# Altium schematic sheet 452006257#BDU控制板1-电源.SchDoc
size A3; SheetNumber: 8; SheetTotal: 14
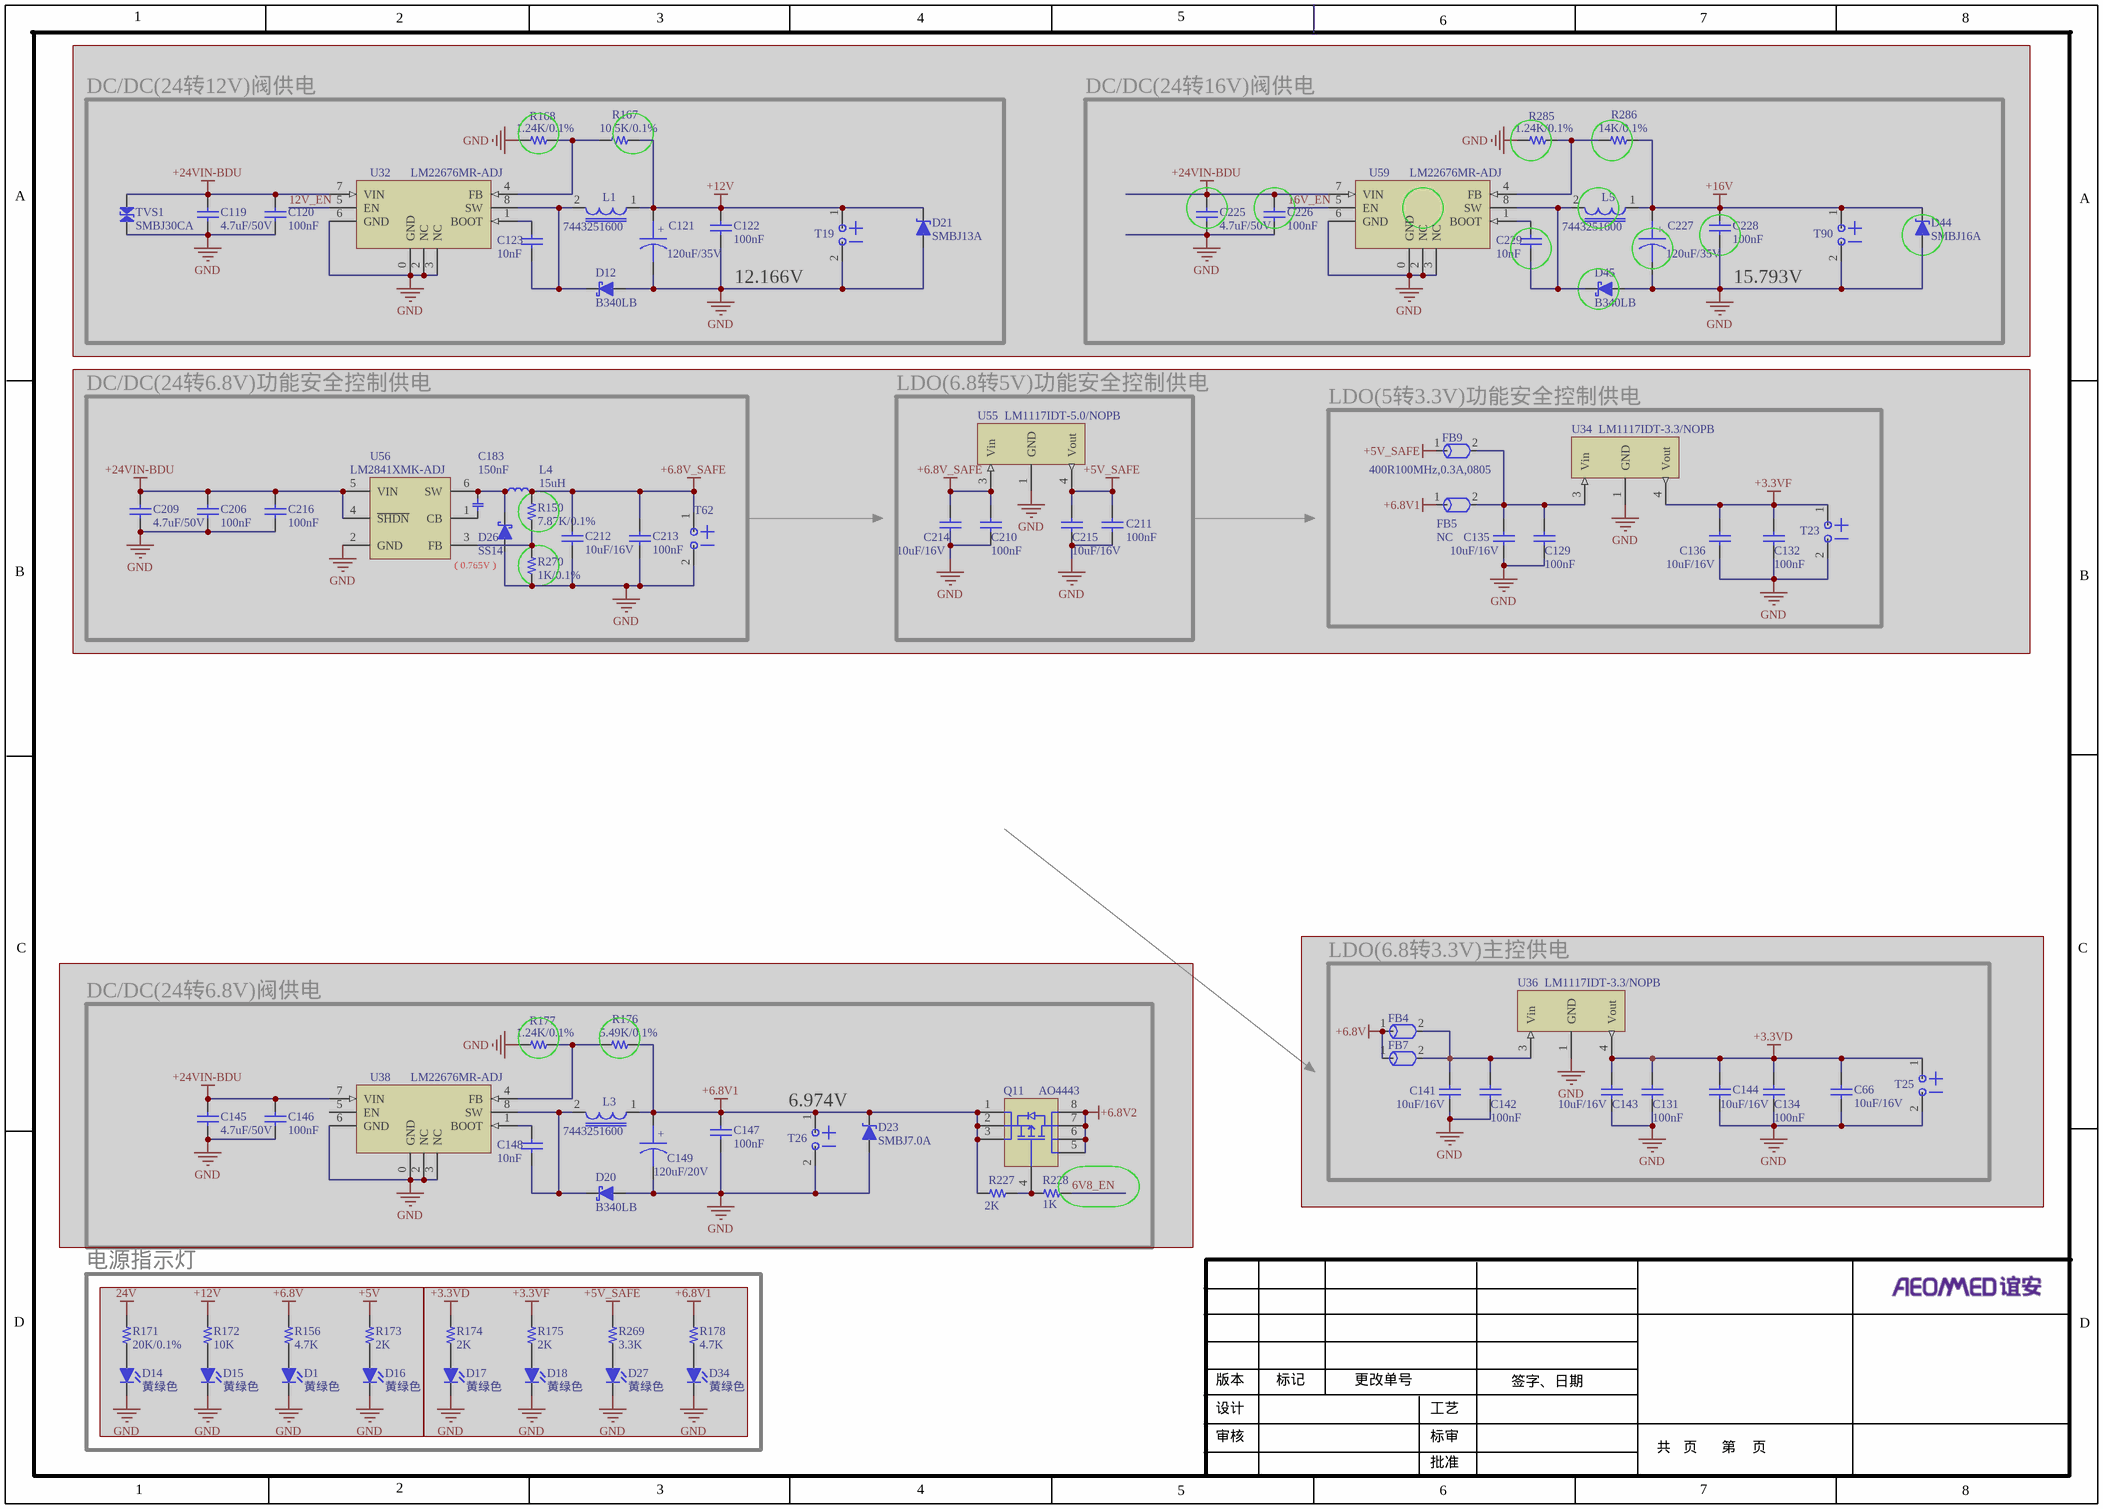
[diagram p0: 452006257#BDU控制板1-电源.SchDoc]

## Parts
C66  10uF/16V  [C-0805]  (masked out: inside a compile mask, not in the netlist)
C119  4.7uF/50V  [C-1210]  (masked out: inside a compile mask, not in the netlist)
C120  100nF  [C-0603]  (masked out: inside a compile mask, not in the netlist)
C121  120uF/35V  [CAP-SMD-φ10]  (masked out: inside a compile mask, not in the netlist)
C122  100nF  [C-0603]  (masked out: inside a compile mask, not in the netlist)
C123  10nF  [C-0603]  (masked out: inside a compile mask, not in the netlist)
C129  100nF  [C-0603]  (masked out: inside a compile mask, not in the netlist)
C131  100nF  [C-0603]  (masked out: inside a compile mask, not in the netlist)
C132  100nF  [C-0603]  (masked out: inside a compile mask, not in the netlist)
C134  100nF  [C-0603]  (masked out: inside a compile mask, not in the netlist)
C135  10uF/16V  [C-0805]  (masked out: inside a compile mask, not in the netlist)
C136  10uF/16V  [C-0805]  (masked out: inside a compile mask, not in the netlist)
C141  10uF/16V  [C-0805]  (masked out: inside a compile mask, not in the netlist)
C142  100nF  [C-0603]  (masked out: inside a compile mask, not in the netlist)
C143  10uF/16V  [C-0805]  (masked out: inside a compile mask, not in the netlist)
C144  10uF/16V  [C-0805]  (masked out: inside a compile mask, not in the netlist)
C145  4.7uF/50V  [C-1210]  (masked out: inside a compile mask, not in the netlist)
C146  100nF  [C-0603]  (masked out: inside a compile mask, not in the netlist)
C147  100nF  [C-0603]  (masked out: inside a compile mask, not in the netlist)
C148  10nF  [C-0603]  (masked out: inside a compile mask, not in the netlist)
C149  120uF/20V  [CAP-SMD-φ6.3]  (masked out: inside a compile mask, not in the netlist)
C183  150nF  [C-0603]  (masked out: inside a compile mask, not in the netlist)
C206  100nF  [C-0603]  (masked out: inside a compile mask, not in the netlist)
C209  4.7uF/50V  [C-1210]  (masked out: inside a compile mask, not in the netlist)
C210  100nF  [C-0603]  (masked out: inside a compile mask, not in the netlist)
C211  100nF  [C-0603]  (masked out: inside a compile mask, not in the netlist)
C212  10uF/16V  [C-0805]  (masked out: inside a compile mask, not in the netlist)
C213  100nF  [C-0603]  (masked out: inside a compile mask, not in the netlist)
C214  10uF/16V  [C-0805]  (masked out: inside a compile mask, not in the netlist)
C215  10uF/16V  [C-0805]  (masked out: inside a compile mask, not in the netlist)
C216  100nF  [C-0603]  (masked out: inside a compile mask, not in the netlist)
C225  4.7uF/50V  [C-1210]  (masked out: inside a compile mask, not in the netlist)
C226  100nF  [C-0603]  (masked out: inside a compile mask, not in the netlist)
C227  120uF/35V  [CAP-SMD-φ10]  (masked out: inside a compile mask, not in the netlist)
C228  100nF  [C-0603]  (masked out: inside a compile mask, not in the netlist)
C229  10nF  [C-0603]  (masked out: inside a compile mask, not in the netlist)
D1  黄绿色  [LED-0805]  (masked out: inside a compile mask, not in the netlist)
D12  B340LB  [DO-214AA/SMB]  (masked out: inside a compile mask, not in the netlist)
D14  黄绿色  [LED-0805]  (masked out: inside a compile mask, not in the netlist)
D15  黄绿色  [LED-0805]  (masked out: inside a compile mask, not in the netlist)
D16  黄绿色  [LED-0805]  (masked out: inside a compile mask, not in the netlist)
D17  黄绿色  [LED-0805]  (masked out: inside a compile mask, not in the netlist)
D18  黄绿色  [LED-0805]  (masked out: inside a compile mask, not in the netlist)
D20  B340LB  [DO-214AA/SMB]  (masked out: inside a compile mask, not in the netlist)
D21  SMBJ13A  [DO-214AA/SMB]  (masked out: inside a compile mask, not in the netlist)
D23  SMBJ7.0A  [DO-214AA/SMB]  (masked out: inside a compile mask, not in the netlist)
D26  SS14  [DO-214AC/SMA]  (masked out: inside a compile mask, not in the netlist)
D27  黄绿色  [LED-0805]  (masked out: inside a compile mask, not in the netlist)
D34  黄绿色  [LED-0805]  (masked out: inside a compile mask, not in the netlist)
D44  SMBJ16A  [DO-214AA/SMB]  (masked out: inside a compile mask, not in the netlist)
D45  B340LB  [DO-214AA/SMB]  (masked out: inside a compile mask, not in the netlist)
FB4  400R100MHz,0.3A,0805  [R-0805]  (value not drawn)  (masked out: inside a compile mask, not in the netlist)
FB5  NC  [R-0805]  (masked out: inside a compile mask, not in the netlist)
FB7  400R100MHz,0.3A,0805  [R-0805]  (value not drawn)  (masked out: inside a compile mask, not in the netlist)
FB9  400R100MHz,0.3A,0805  [R-0805]  (masked out: inside a compile mask, not in the netlist)
L1  7443251600  [L-1050-WE-PD]  (masked out: inside a compile mask, not in the netlist)
L3  7443251600  [L-7050-WE-HCI]  (masked out: inside a compile mask, not in the netlist)
L4  15uH  [L-WE-TPC S]  (masked out: inside a compile mask, not in the netlist)
L5  7443251600  [L-1050-WE-PD]  (masked out: inside a compile mask, not in the netlist)
Q11  AO4443  [SOIC8]  (masked out: inside a compile mask, not in the netlist)
R150  7.87K/0.1%  [R-0603]  (masked out: inside a compile mask, not in the netlist)
R156  4.7K  [R-0603]  (masked out: inside a compile mask, not in the netlist)
R167  10.5K/0.1%  [R-0603]  (masked out: inside a compile mask, not in the netlist)
R168  1.24K/0.1%  [R-0603]  (masked out: inside a compile mask, not in the netlist)
R171  20K/0.1%  [R-0603]  (masked out: inside a compile mask, not in the netlist)
R172  10K  [R-0603]  (masked out: inside a compile mask, not in the netlist)
R173  2K  [R-0603]  (masked out: inside a compile mask, not in the netlist)
R174  2K  [R-0603]  (masked out: inside a compile mask, not in the netlist)
R175  2K  [R-0603]  (masked out: inside a compile mask, not in the netlist)
R176  5.49K/0.1%  [R-0603]  (masked out: inside a compile mask, not in the netlist)
R177  1.24K/0.1%  [R-0603]  (masked out: inside a compile mask, not in the netlist)
R178  4.7K  [R-0603]  (masked out: inside a compile mask, not in the netlist)
R227  2K  [R-0603]  (masked out: inside a compile mask, not in the netlist)
R228  1K  [R-0603]  (masked out: inside a compile mask, not in the netlist)
R269  3.3K  [R-0603]  (masked out: inside a compile mask, not in the netlist)
R270  1K/0.1%  [R-0603]  (masked out: inside a compile mask, not in the netlist)
R285  1.24K/0.1%  [R-0603]  (masked out: inside a compile mask, not in the netlist)
R286  14K/0.1%  [R-0603]  (masked out: inside a compile mask, not in the netlist)
T19  POWER_TEST  [BT]  (value not drawn)  (masked out: inside a compile mask, not in the netlist)
T23  POWER_TEST  [BT]  (value not drawn)  (masked out: inside a compile mask, not in the netlist)
T25  POWER_TEST  [BT]  (value not drawn)  (masked out: inside a compile mask, not in the netlist)
T26  POWER_TEST  [BT]  (value not drawn)  (masked out: inside a compile mask, not in the netlist)
T62  POWER_TEST  [BT]  (value not drawn)  (masked out: inside a compile mask, not in the netlist)
T90  POWER_TEST  [BT]  (value not drawn)  (masked out: inside a compile mask, not in the netlist)
TVS1  SMBJ30CA  [DO-214AA/SMB-J-Bend]  (masked out: inside a compile mask, not in the netlist)
U32  LM22676MR-ADJ  [SOIC-8(4.90*3.9)-EPAD]  (masked out: inside a compile mask, not in the netlist)
U34  LM1117IDT-3.3/NOPB  [TO-252]  (masked out: inside a compile mask, not in the netlist)
U36  LM1117IDT-3.3/NOPB  [TO-252]  (masked out: inside a compile mask, not in the netlist)
U38  LM22676MR-ADJ  [SOIC-8(4.90*3.9)-EPAD]  (masked out: inside a compile mask, not in the netlist)
U55  LM1117IDT-5.0/NOPB  [TO-252]  (masked out: inside a compile mask, not in the netlist)
U56  LM2841XMK-ADJ  [SOT23-6]  (masked out: inside a compile mask, not in the netlist)
U59  LM22676MR-ADJ  [SOIC-8(4.90*3.9)-EPAD]  (masked out: inside a compile mask, not in the netlist)

## Blocks framed on the sheet
DC/DC(24转12V)阀供电: C119-C123 D12 D21 L1 R167 R168 T19 TVS1 U32
DC/DC(24转16V)阀供电: C225-C229 D44 D45 L5 R285 R286 T90 U59
DC/DC(24转6.8V)功能安全控制供电: C183 C206 C209 C212 C213 C216 D26 L4 R150 R270 T62 U56
LDO(6.8转5V)功能安全控制供电: C210 C211 C214 C215 U55
LDO(5转3.3V)功能安全控制供电: C129 C132 C135 C136 FB5 FB9 T23 U34
LDO(6.8转3.3V)主控供电: C66 C131 C134 C141-C144 FB4 FB7 T25 U36
DC/DC(24转6.8V)阀供电: C145-C149 D20 D23 L3 Q11 R176 R177 R227 R228 T26 U38
电源指示灯: D1 D14-D18 D27 D34 R156 R171-R175 R178 R269

## Notes on the sheet
- 12.166V
- 15.793V
- （0.765V）
- 6.974V
- 1
- 2
- 3
- 4
- 5
- 6
- 7
- 8
- A
- B
- C
- D
- 版本
- 标记
- 更改单号
- 签字、日期
- 设计
- 审核
- 工艺
- 标审
- 共   页      第    页
- 批准
- (in symbol 10uF/16V贴片铝电解) +
- (in symbol 100uF/25V贴片铝电解) +

## Library data of the parts
C66 C135 C136 C141 C143 C144 C214 C215 = C-1210
C119 C120 C122 C129 C131 C132 C134 C142 C145-C147 C206 C209-C211 C213 C216 C225 C226 C228 = 100nF_1: 贴片瓷介电容100nF±5%,0805; 物料编号: 210001894; 详细描述: X7R,50V,三星CL21B104JBCNNNC; 版本: V1.00; 制造商: 三星; 名称: 贴片瓷介电容100nF±5%,0805
C121 C227 = 10uF/16V贴片铝电解: 版本: V1.00; 名称: 贴片铝电解电容10uF/16V; 物料编号: APLLY; 详细描述: 4.0mm X 5.3mm 体积，贴片铝电解电容10uF/16V; 制造商: TBD
C123 C148 C229 = 10nF_1: 贴片瓷介电容10nF±10%,0805; 物料编号: 210001895; 详细描述: X7R,50V,三星CL21B103KBANNNC; 版本: V1.00; 名称: 贴片瓷介电容10nF±10%,0805; 制造商: *
C149 = 100uF/25V贴片铝电解: 名称: 贴片铝电解电容100uF/25V; 版本: V1.00; 详细描述: 6.3mm X 7.7mm体积，贴片铝电解电容100uF/25V; 制造商: TBD; 物料编号: APPLY
C183 = C-103
C212 = 100nF_1: 物料编号: 210001894; 详细描述: X7R,50V,三星CL21B104JBCNNNC; 版本: V1.00; 名称: 贴片瓷介电容100nF±5%,0805; 制造商: 三星
D1 D14-D18 D27 D34 = LED-0805
D12 D20 D26 D45 = Diode-肖特基-214AA  (SMB): 版本: V1.00; 物料编号: APLLY; 详细描述: 贴片，二极管
D21 D23 D44 = Diode-稳压-213AB/LL34/MiniMELF: 厂家: *; 物料名称: *; 物料编号: *; 详细描述: *
FB4 FB5 FB7 FB9 = FB_1K/500mA_0805: Rdc0.3Ω,伍尔特,742792032; 名称: 贴片磁珠1K/500mA，0805; 版本: V1.00; 物料编号: 210001925; 详细描述: Rdc0.3,R材料,TDK MMZ2012R102A; 制造商: TDK
L1 L3 L5 = GPSR0750-220M
L4 = L: WE 744031150
Q11 = AO4443: AOS,AO4443,SOIC-8,-55~+150°C,ROHS; 名称: P-MOS AO4443; 制造商: AOS; 详细描述: AOS,AO4443,SOIC-8,-55~+150°C,ROHS
R150 R178 R270 = R-0603
R156 R167 R171-R176 R227 R228 R269 R286 = 10K_1: 国巨RC0805FR-0710K; 版本: V1.00; 名称: 贴片电阻10K±1%; 物料编号: 210001830; 详细描述: 0805,1/8W,国巨RC0805FR-0710K; 制造商: 国巨
R168 R177 R285 = 3.3K_1: 国巨RC0805FR-073K3; 物料编号: 210001835; 详细描述: 0805,1/8W,国巨RC0805FR-073K3; 制造商: 国巨; 版本: V1.00; 名称: 贴片电阻3.3K±1%
TVS1 = TVS-DO-214AA/SMB-J-Bend -BI
U32 U38 U59 = LM22676MR-ADJ: 版本: V1.00; 名称: 芯片LM22676MR-ADJ; 详细描述: N沟道MOS管，输出电压可调，电流3A，; 制造商: NS; 物料编号: APPLY
U34 U36 U55 = LM1117IDT-5.0/NOPB: 品牌：TI，型号：LM1117IDT-5.0/NOPB，800-mA Low-Dropout，TO-252，-40~+125°C,ROHS
U56 = LM2840